# EAGLE schematic fish_electronics2 (EAGLE 6.3)

## Sheet 1 of 4
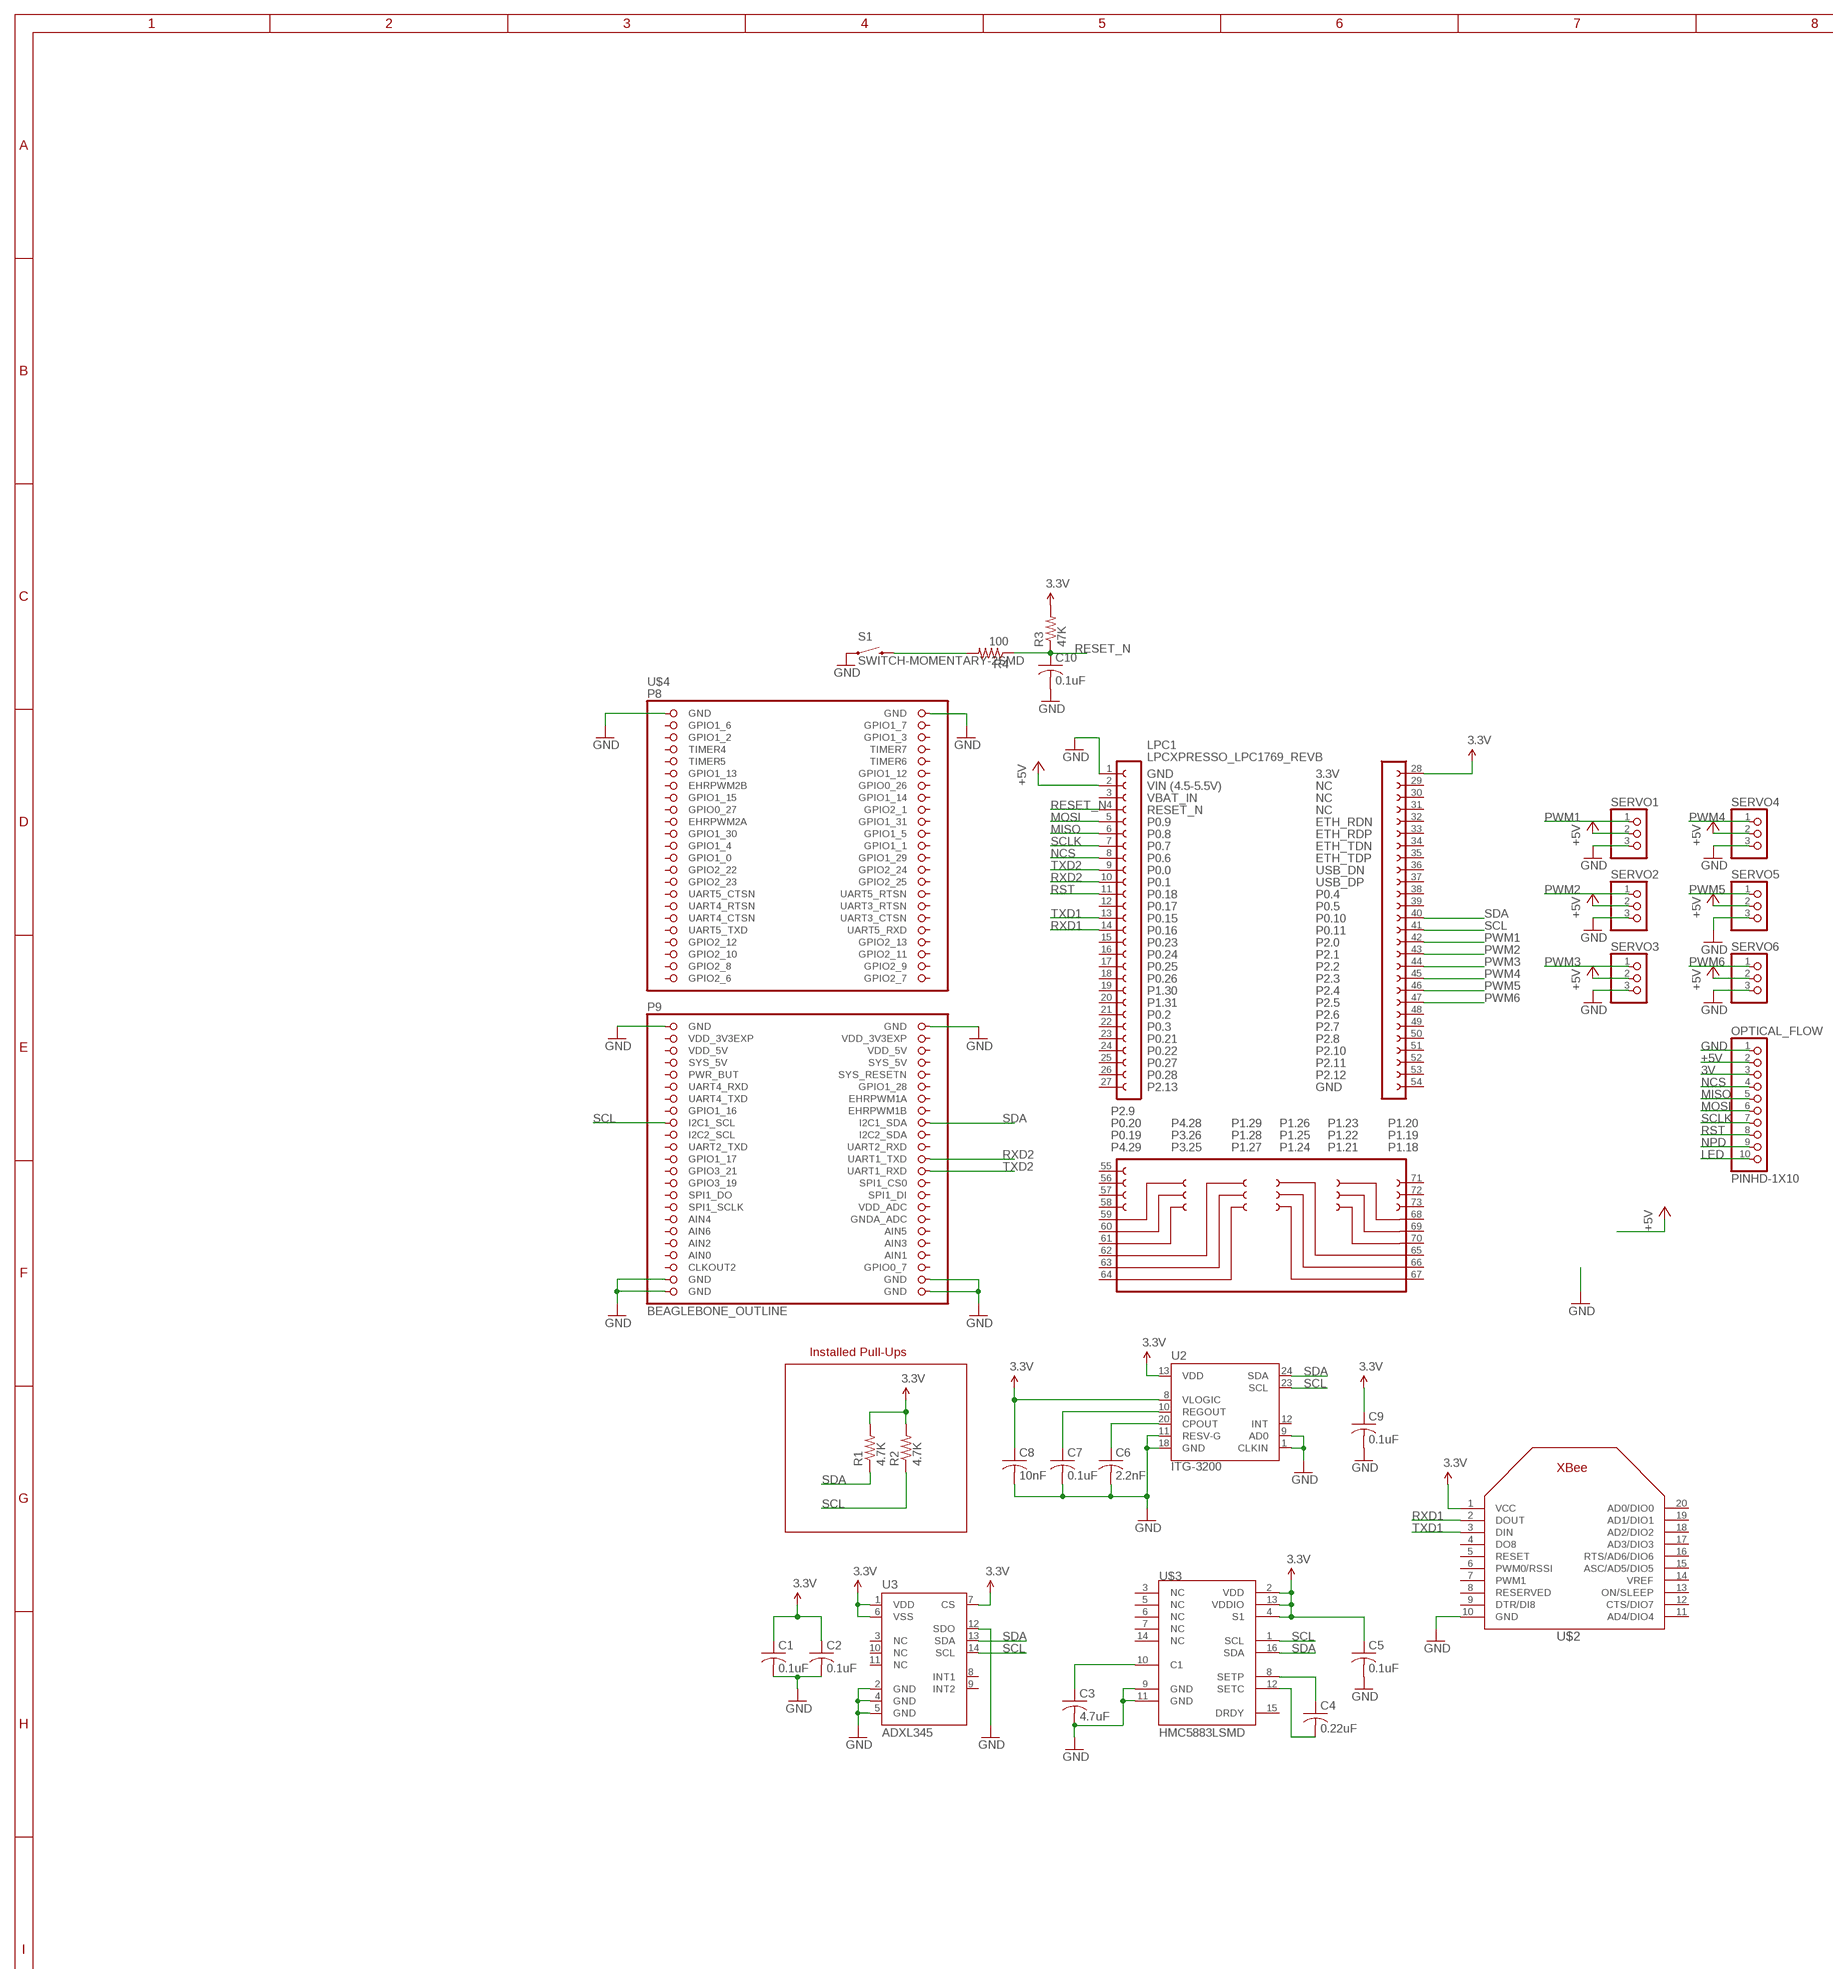
[diagram p0: schematic, sheet 1, part 1 of 2]
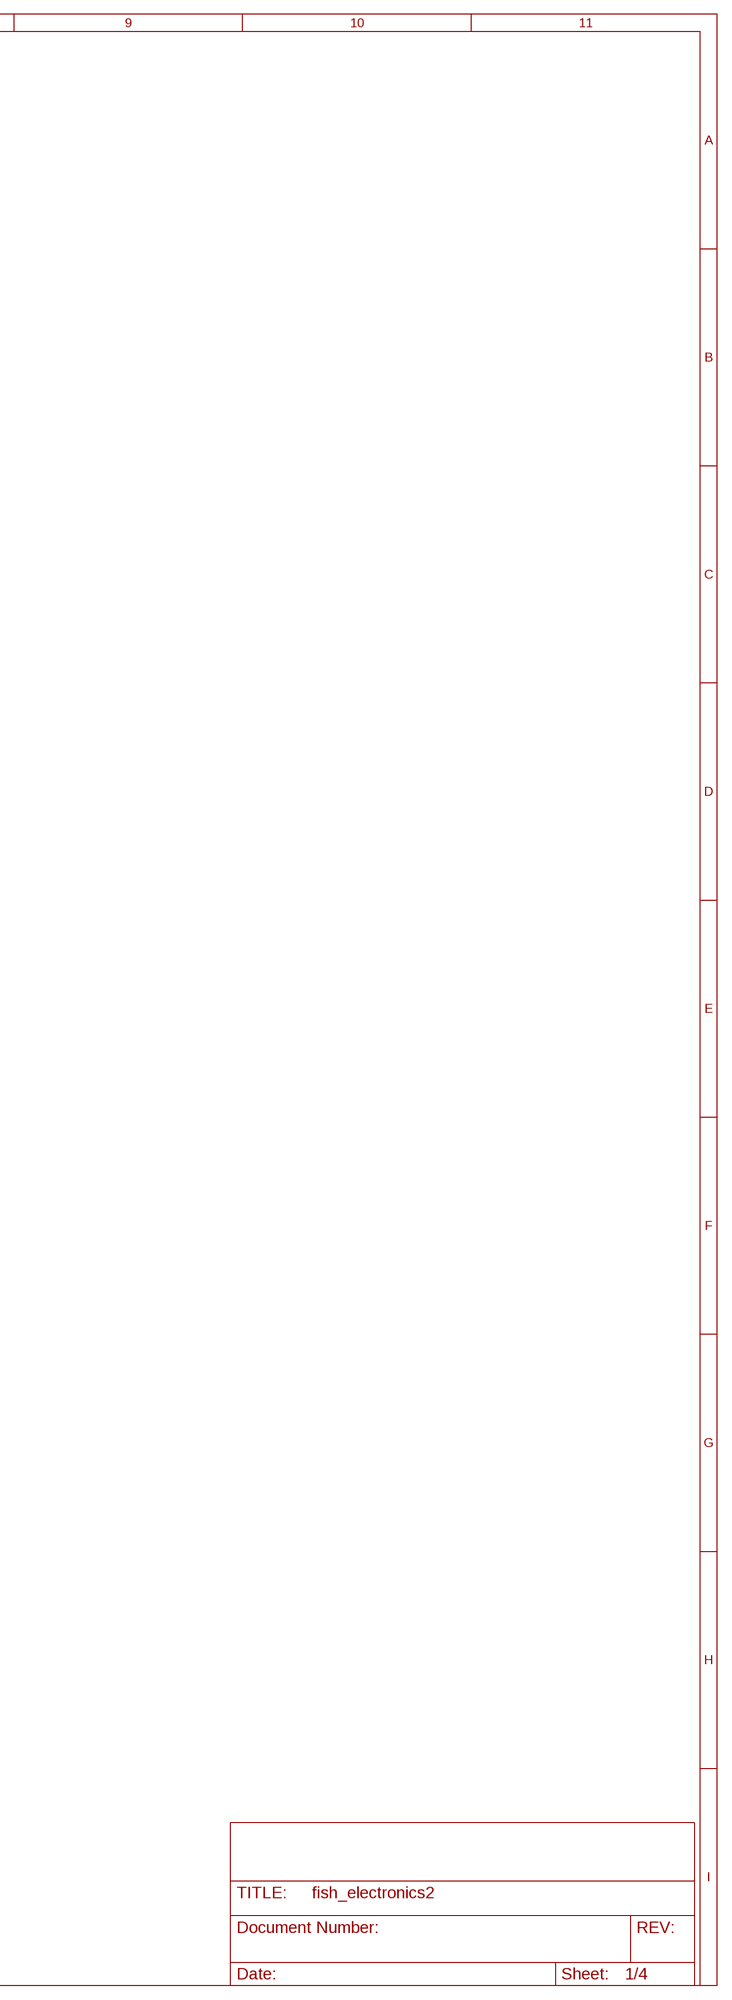
[diagram p1: schematic, sheet 1, part 2 of 2]

### Parts
C1  0.1uF  C-USC0805  [C0805]
C2  0.1uF  C-USC0805  [C0805]
C3  4.7uF  C-USC0805  [C0805]
C4  0.22uF  C-USC0805  [C0805]
C5  0.1uF  C-USC0805  [C0805]
C6  2.2nF  C-USC0805  [C0805]
C7  0.1uF  C-USC0805  [C0805]
C8  10nF  C-USC0805  [C0805]
C9  0.1uF  C-USC0805  [C0805]
C10  0.1uF  C-USC0805  [C0805]
LPC1  LPCXPRESSO_LPC1769_REVB  [LPCXPRESSO_LPC1769]
OPTICAL_FLOW  PINHD-1X10  [1X10-BIG]
R1  4.7K  R-US_R0805  [R0805]
R2  4.7K  R-US_R0805  [R0805]
R3  47K  R-US_R0805  [R0805]
R4  100  R-US_R0805  [R0805]
S1  SWITCH-MOMENTARY-2SMD  [TACTILE_SWITCH_SMD]
SERVO1  PINHD-1X3CB  [1X03-CLEANBIG]
SERVO2  PINHD-1X3CB  [1X03-CLEANBIG]
SERVO3  PINHD-1X3CB  [1X03-CLEANBIG]
SERVO4  PINHD-1X3CB  [1X03-CLEANBIG]
SERVO5  PINHD-1X3CB  [1X03-CLEANBIG]
SERVO6  PINHD-1X3CB  [1X03-CLEANBIG]
U2  ITG-3200  [QFN-24]
U3  ADXL345  [LGA14]
U$2  XBEE  [XBEE]
U$3  HMC5883LSMD  [16LPCC]
U$4  BEAGLEBONE_OUTLINE  [BEAGLEBONE_SHIELD]

### Nets
3.3V: C1.1 C2.1 C5.1 C8.1 C9.1 LPC1.28 R1.2 R2.2 R3.2 U2.8(VLOGIC) U2.13(VDD) U3.1(VDD) U3.6(VSS) U3.7(CS) U$2.1(VCC) U$3.2(VDD) U$3.4(S1) U$3.13(VDDIO)
3V: OPTICAL_FLOW.3
+5V: LPC1.2 OPTICAL_FLOW.2 SERVO1.2 SERVO2.2 SERVO3.2 SERVO4.2 SERVO5.2 SERVO6.2
GND: C1.2 C2.2 C3.2 C5.2 C6.2 C7.2 C8.2 C9.2 C10.2 LPC1.1 OPTICAL_FLOW.1 S1.1 SERVO1.3 SERVO2.3 SERVO3.3 SERVO4.3 SERVO5.3 SERVO6.3 U2.1(CLKIN) U2.9(AD0) U2.11(RESV-G) U2.18(GND) U3.2(GND) U3.4(GND) U3.5(GND) U3.12(SDO) U$2.10(GND) U$3.9(GND) U$3.11(GND) U$4.1(GND) U$4.2(GND) U$4.47(GND) U$4.48(GND) U$4.89(GND) U$4.90(GND) U$4.91(GND) U$4.92(GND) ; also sheet 2,3,4
LED: OPTICAL_FLOW.10
M3_NRESET_BTN: R4.2 S1.3
MISO: LPC1.6 OPTICAL_FLOW.5
MOSI: LPC1.5 OPTICAL_FLOW.6
N$1: C3.1 U$3.10(C1)
N$2: C4.1 U$3.8(SETP)
N$3: C4.2 U$3.12(SETC)
N$5: C6.1 U2.20(CPOUT)
N$7: C7.1 U2.10(REGOUT)
NCS: LPC1.8 OPTICAL_FLOW.4
NPD: OPTICAL_FLOW.9
PWM1: LPC1.42 SERVO1.1
PWM2: LPC1.43 SERVO2.1
PWM3: LPC1.44 SERVO3.1
PWM4: LPC1.45 SERVO4.1
PWM5: LPC1.46 SERVO5.1
PWM6: LPC1.47 SERVO6.1
RESET_N: C10.1 LPC1.4 R3.1 R4.1
RST: LPC1.11 OPTICAL_FLOW.8
RXD1: LPC1.14 U$2.2(DOUT)
RXD2: LPC1.10 U$4.70(UART1_TXD)
SCL: LPC1.41 R2.1 U2.23(SCL) U3.14(SCL) U$3.1(SCL) U$4.63(I2C1_SCL)
SCLK: LPC1.7 OPTICAL_FLOW.7
SDA: LPC1.40 R1.1 U2.24(SDA) U3.13(SDA) U$3.16(SDA) U$4.64(I2C1_SDA)
TXD1: LPC1.13 U$2.3(DIN)
TXD2: LPC1.9 U$4.72(UART1_RXD)
Unconnected: LPC1.3 LPC1.12 LPC1.15 LPC1.16 LPC1.17 LPC1.18 LPC1.19 LPC1.20 LPC1.21 LPC1.22 LPC1.23 LPC1.24 LPC1.25 LPC1.26 LPC1.27 LPC1.29 LPC1.30 LPC1.31 LPC1.32 LPC1.33 LPC1.34 LPC1.35 LPC1.36 LPC1.37 LPC1.38 LPC1.39 LPC1.48 LPC1.49 LPC1.50 LPC1.51 LPC1.52 LPC1.53 LPC1.54 LPC1.55 LPC1.56 LPC1.57 LPC1.58 LPC1.59 LPC1.60 LPC1.61 LPC1.62 LPC1.63 LPC1.64 LPC1.65 LPC1.66 LPC1.67 LPC1.68 LPC1.69 LPC1.70 LPC1.71 LPC1.72 LPC1.73 U2.12(INT) U3.3(NC) U3.8(INT1) U3.9(INT2) U3.10(NC) U3.11(NC) U$2.4(DO8) U$2.5(RESET) U$2.6(PWM0/RSSI) U$2.7(PWM1) U$2.8(RESERVED) U$2.9(DTR/DI8) U$2.11(AD4/DIO4) U$2.12(CTS/DIO7) U$2.13(ON/SLEEP) U$2.14(VREF) U$2.15(ASC/AD5/DIO5) U$2.16(RTS/AD6/DIO6) U$2.17(AD3/DIO3) U$2.18(AD2/DIO2) U$2.19(AD1/DIO1) U$2.20(AD0/DIO0) U$3.3(NC) U$3.5(NC) U$3.6(NC) U$3.7(NC) U$3.14(NC) U$3.15(DRDY) U$4.3(GPIO1_6) U$4.4(GPIO1_7) U$4.5(GPIO1_2) U$4.6(GPIO1_3) U$4.7(TIMER4) U$4.8(TIMER7) U$4.9(TIMER5) U$4.10(TIMER6) U$4.11(GPIO1_13) U$4.12(GPIO1_12) U$4.13(EHRPWM2B) U$4.14(GPIO0_26) U$4.15(GPIO1_15) U$4.16(GPIO1_14) U$4.17(GPIO0_27) U$4.18(GPIO2_1) U$4.19(EHRPWM2A) U$4.20(GPIO1_31) U$4.21(GPIO1_30) U$4.22(GPIO1_5) U$4.23(GPIO1_4) U$4.24(GPIO1_1) U$4.25(GPIO1_0) U$4.26(GPIO1_29) U$4.27(GPIO2_22) U$4.28(GPIO2_24) U$4.29(GPIO2_23) U$4.30(GPIO2_25) U$4.31(UART5_CTSN) U$4.32(UART5_RTSN) U$4.33(UART4_RTSN) U$4.34(UART3_RTSN) U$4.35(UART4_CTSN) U$4.36(UART3_CTSN) U$4.37(UART5_TXD) U$4.38(UART5_RXD) U$4.39(GPIO2_12) U$4.40(GPIO2_13) U$4.41(GPIO2_10) U$4.42(GPIO2_11) U$4.43(GPIO2_8) U$4.44(GPIO2_9) U$4.45(GPIO2_6) U$4.46(GPIO2_7) U$4.54(SYS_5V) U$4.55(PWR_BUT) U$4.56(SYS_RESETN) U$4.57(UART4_RXD) U$4.58(GPIO1_28) U$4.59(UART4_TXD) U$4.60(EHRPWM1A) U$4.61(GPIO1_16) U$4.62(EHRPWM1B) U$4.65(I2C2_SCL) U$4.66(I2C2_SDA) U$4.67(UART2_TXD) U$4.68(UART2_RXD) U$4.69(GPIO1_17) U$4.71(GPIO3_21) U$4.73(GPIO3_19) U$4.74(SPI1_CS0) U$4.75(SPI1_DO) U$4.76(SPI1_DI) U$4.77(SPI1_SCLK) U$4.78(VDD_ADC) U$4.79(AIN4) U$4.80(GNDA_ADC) U$4.81(AIN6) U$4.82(AIN5) U$4.83(AIN2) U$4.84(AIN3) U$4.86(AIN1) U$4.87(CLKOUT2) U$4.88(GPIO0_7)

### Notes on the sheet
- Installed Pull-Ups

## Sheet 2 of 4
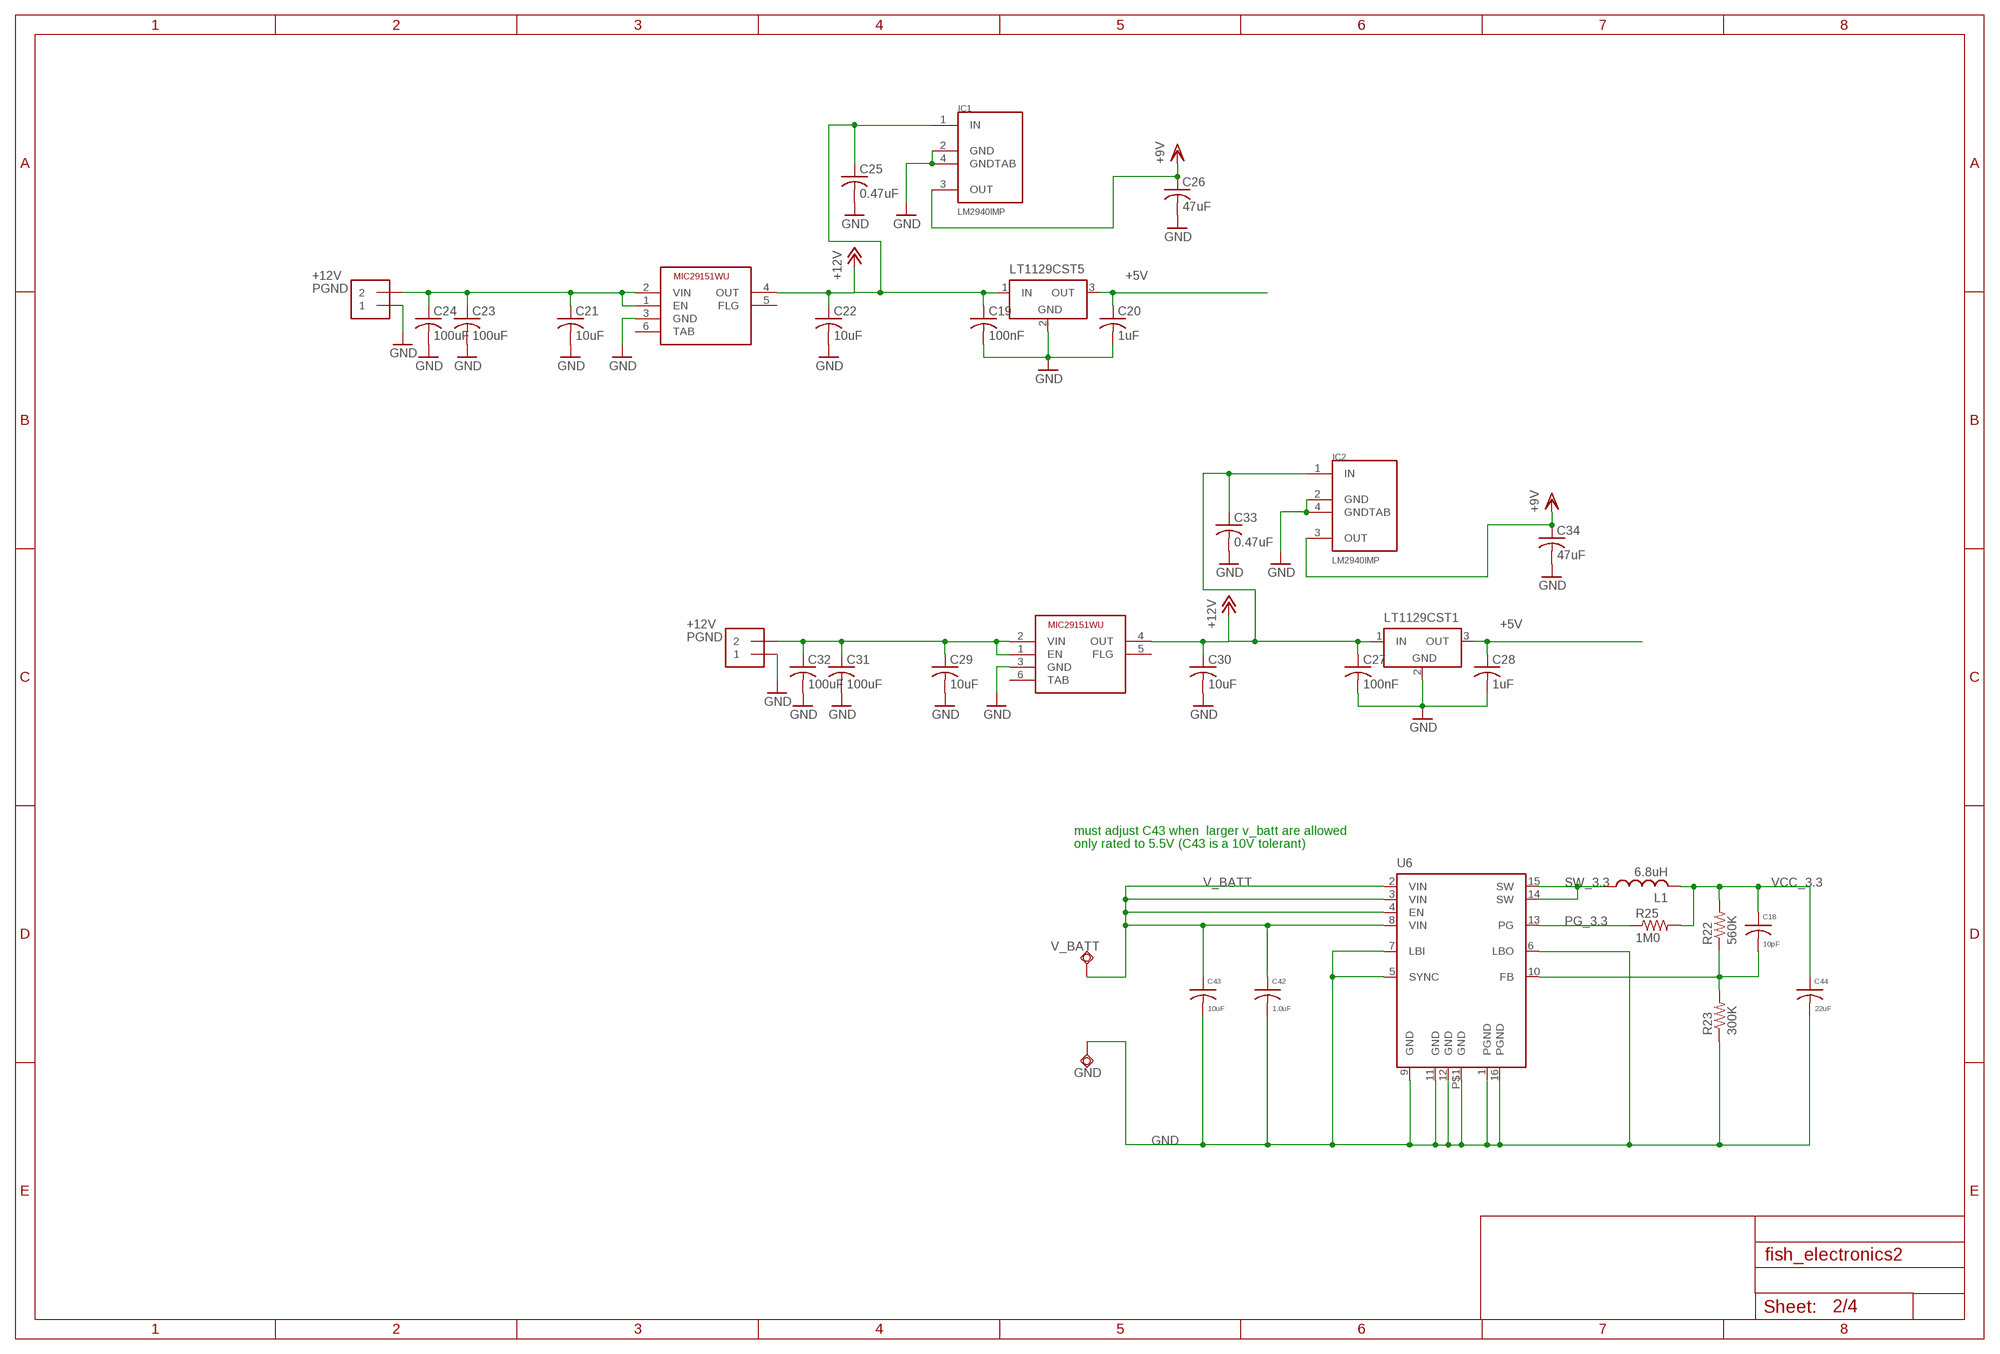
[diagram p2: schematic, sheet 2]

### Parts
C18  10pF  C0402  [C0402]
C19  100nF  C-USC0805  [C0805]
C20  1uF  C-USC0805  [C0805]
C21  10uF  C-USC0805  [C0805]
C22  10uF  C-USC0805  [C0805]
C23  100uF  C-USC2220K  [C2220K]
C24  100uF  C-USC2220K  [C2220K]
C25  0.47uF  C-USC0805  [C0805]
C26  47uF  C-USC1206  [C1206]
C27  100nF  C-USC0805  [C0805]
C28  1uF  C-USC0805  [C0805]
C29  10uF  C-USC0805  [C0805]
C30  10uF  C-USC0805  [C0805]
C31  100uF  C-USC2220K  [C2220K]
C32  100uF  C-USC2220K  [C2220K]
C33  0.47uF  C-USC0805  [C0805]
C34  47uF  C-USC1206  [C1206]
C42  1.0uF  C0603  [C0603]
C43  10uF  C0805  [C0805]
C44  22uF  C0805-R  [C0805R]
GND  TPSQPAD1-17  [P1-17]
IC1  LM2940IMP  [SOT223]
IC2  LM2940IMP  [SOT223]
J1  1X2-3.5MM  [1X2-3.5MM]
J2  1X2-3.5MM  [1X2-3.5MM]
L1  6.8uH  LELL3GM  [ELL3GM]
LT1129CST1  LT1129CST5  [SOT223]
LT1129CST5  LT1129CST5  [SOT223]
R22  560K  R0402-R  [C0402R]
R23  300K  R0402-R  [C0402R]
R25  1M0  R0402-R  [C0402R]
U6  TPS62110  TPS62111  [PQFP16]
U$1  MIC29151WU  [TO263-5]
U$5  MIC29151WU  [TO263-5]
V_BATT  TPSQPAD1-17  [P1-17]

### Nets
+12V [Power3]: C19.1 C22.1 C25.1 C27.1 C30.1 C33.1 IC1.1(IN) IC2.1(IN) LT1129CST1.1(IN) LT1129CST5.1(IN) U$1.4(OUT) U$5.4(OUT)
FB_3.3: C18.2 R22.1 R23.2 U6.10(FB)
GND: C19.2 C20.2 C21.2 C22.2 C23.2 C24.2 C25.2 C26.2 C27.2 C28.2 C29.2 C30.2 C31.2 C32.2 C33.2 C34.2 C42.2 C43.2 C44.2 GND.1(TP) IC1.2(GND) IC1.4(GNDTAB) IC2.2(GND) IC2.4(GNDTAB) J1.1 J2.1 LT1129CST1.2(GND) LT1129CST5.2(GND) R23.1 U6.1(PGND) U6.5(SYNC) U6.6(LBO) U6.7(LBI) U6.9(GND) U6.11(GND) U6.12(GND) U6.16(PGND) U6.P$1(GND) U$1.3(GND) U$5.3(GND) ; also sheet 1,3,4
N$12: C29.1 C31.1 C32.1 J2.2 U$5.1(EN) U$5.2(VIN)
N$13 [Power3]: C28.1 LT1129CST1.3(OUT)
N$19 [Power3]: C20.1 LT1129CST5.3(OUT)
N$22: C21.1 C23.1 C24.1 J1.2 U$1.1(EN) U$1.2(VIN)
PG_3.3: R25.1 U6.13(PG)
SW_3.3: L1.1 U6.14(SW) U6.15(SW)
V_BATT [xxwide]: C42.1 C43.1 U6.2(VIN) U6.3(VIN) U6.4(EN) U6.8(VIN) V_BATT.1(TP)
VCC_3.3 [Power1]: C18.1 C44.1 L1.2 R22.2 R25.2
VDD [Power3]: C26.1 C34.1 IC1.3(OUT) IC2.3(OUT) ; supply symbol labelled +9V
Unconnected: U$1.5(FLG) U$1.6(TAB) U$5.5(FLG) U$5.6(TAB)

### Notes on the sheet
- +12V | +5V
- PGND
- +12V | +5V
- PGND
- must adjust C43 when  larger v_batt are allowed
- only rated to 5.5V (C43 is a 10V tolerant)

## Sheet 3 of 4
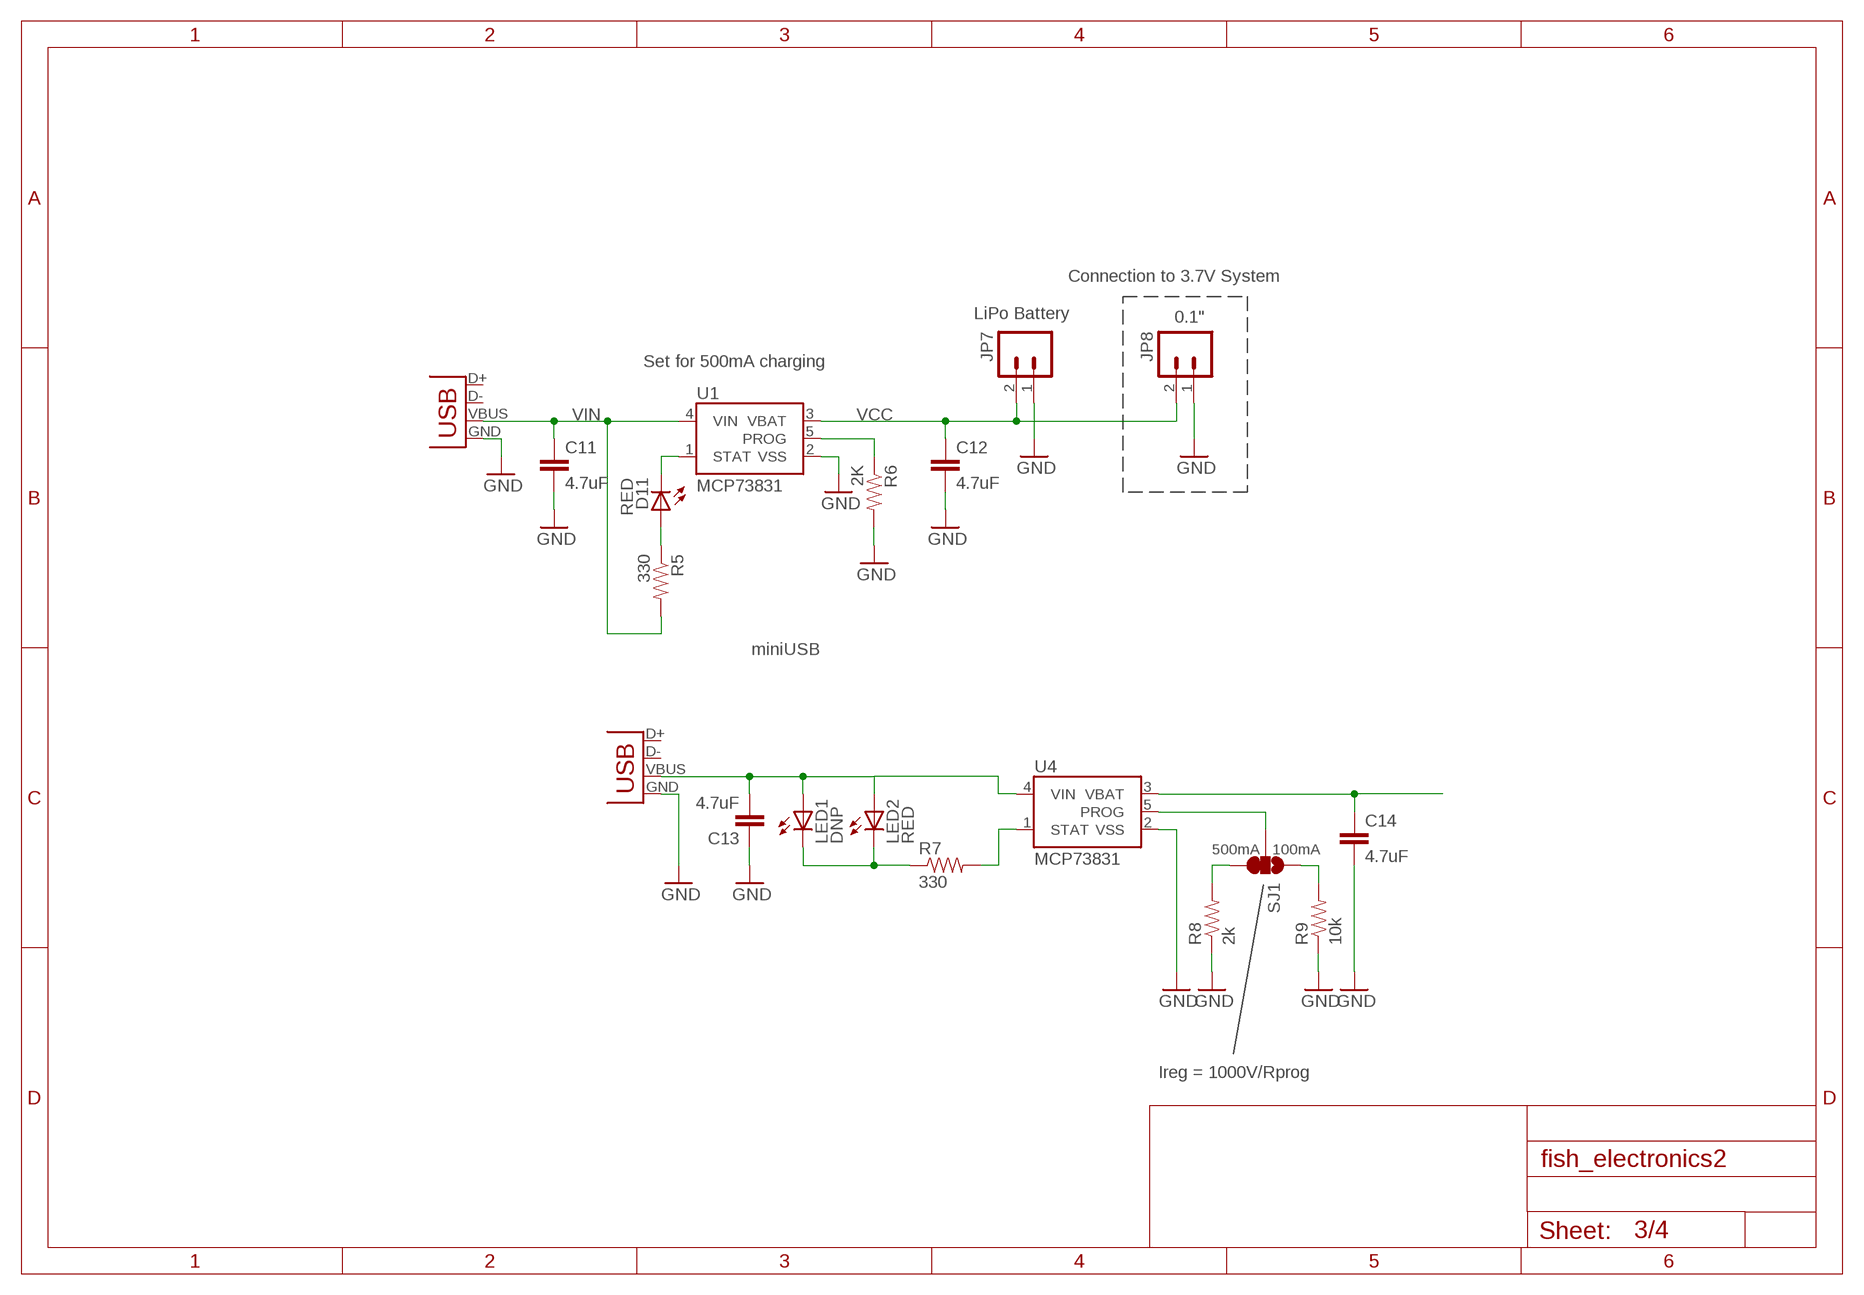
[diagram p3: schematic, sheet 3]

### Parts
C11  4.7uF  CAP0402-CAP  [0402-CAP]
C12  4.7uF  CAP0402-CAP  [0402-CAP]
C13  4.7uF  CAP0402-CAP  [0402-CAP]
C14  4.7uF  CAP0402-CAP  [0402-CAP]
D11  RED  LED0603  [LED-0603]
JP7  LiPo Battery  M02-JST-2MM-SMT  [JST-2-SMD]
JP8  M02PTH  [1X02]
LED1  DNP  LED3MM  [LED3MM]
LED2  RED  LED0603  [LED-0603]
R5  330  RESISTOR0402-RES  [0402-RES]
R6  2K  RESISTOR0402-RES  [0402-RES]
R7  330  RESISTOR0402-RES  [0402-RES]
R8  2k  RESISTOR0402-RES  [0402-RES]
R9  10k  RESISTOR0402-RES  [0402-RES]
SJ1  SOLDERJUMPER_2WAYS  [SJ_3]
U1  MCP73831  [SOT23-5]
U4  MCP73831  [SOT23-5]
X1  Micro USB  USBSMD  [USB-MINIB]
X2  USBSMD  [USB-MINIB]

### Nets
GND: C11.2 C12.2 C13.1 C14.2 JP7.1 JP8.1 R6.2 R8.1 R9.1 U1.2(VSS) U4.2(VSS) X1.GND X2.GND ; also sheet 1,2,4
N$4: D11.A R5.1
N$6: C13.2 LED1.A LED2.A U4.4(VIN) X2.VBUS
N$8: R9.2 SJ1.1
N$9: R8.2 SJ1.3
N$10: R7.2 U4.1(STAT)
N$11: LED1.K(C) LED2.C R7.1
PROG: R6.1 U1.5(PROG)
PROG1: SJ1.2 U4.5(PROG)
STAT: D11.C U1.1(STAT)
VBAT: C14.1 U4.3(VBAT)
VCC: C12.1 JP7.2 JP8.2 U1.3(VBAT) ; also sheet 4
VIN: C11.1 R5.2 U1.4(VIN) X1.VBUS
Unconnected: X1.D+ X1.D- X2.D+ X2.D-

### Notes on the sheet
- Connection to 3.7V System
- 0.1"
- Set for 500mA charging
- miniUSB
- 500mA | 100mA
- Ireg = 1000V/Rprog

## Sheet 4 of 4
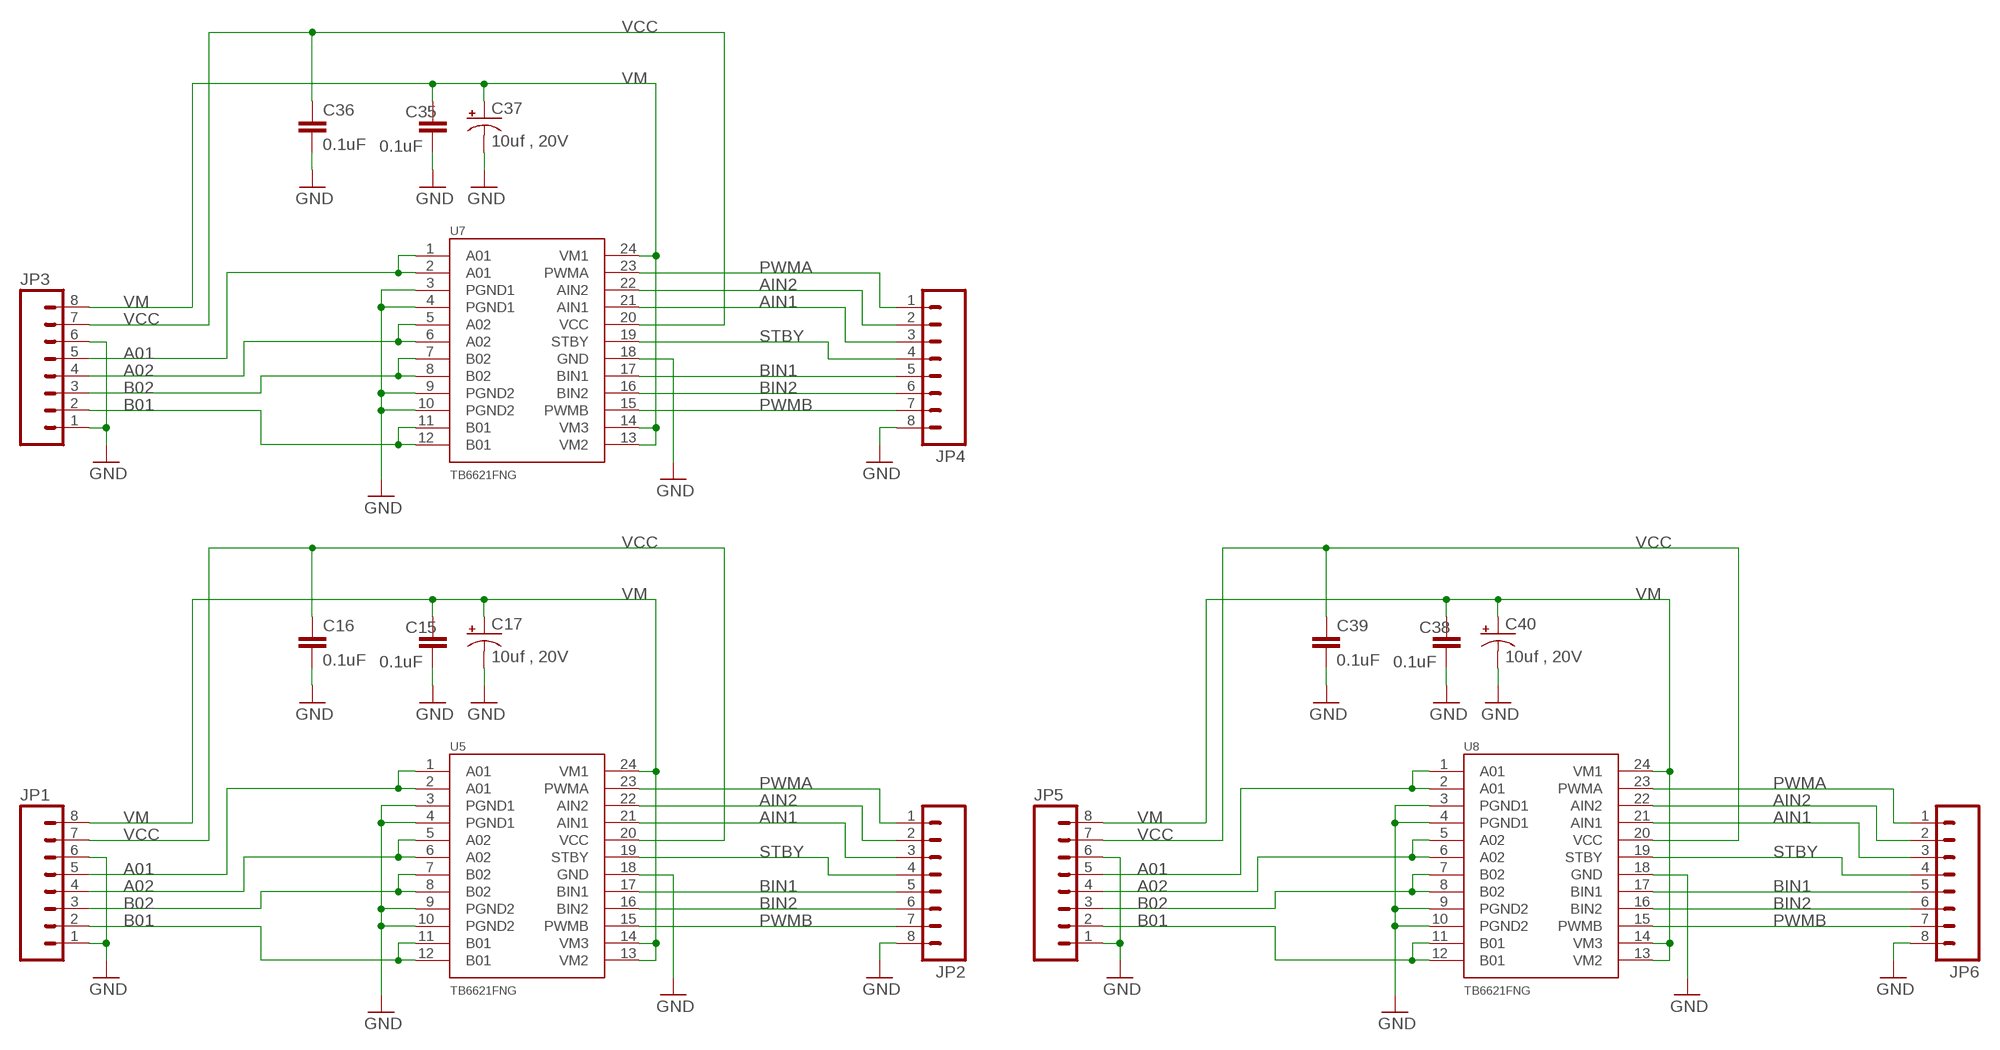
[diagram p4: schematic, sheet 4]

### Parts
C15  0.1uF  CAP0402-CAP  [0402-CAP]
C16  0.1uF  CAP0402-CAP  [0402-CAP]
C17  10uf , 20V  CAP_POL3528  [EIA3528]
C35  0.1uF  CAP0402-CAP  [0402-CAP]
C36  0.1uF  CAP0402-CAP  [0402-CAP]
C37  10uf , 20V  CAP_POL3528  [EIA3528]
C38  0.1uF  CAP0402-CAP  [0402-CAP]
C39  0.1uF  CAP0402-CAP  [0402-CAP]
C40  10uf , 20V  CAP_POL3528  [EIA3528]
JP1  M08LONGPADS  [1X08_LONGPADS]
JP2  M08LONGPADS  [1X08_LONGPADS]
JP3  M08LONGPADS  [1X08_LONGPADS]
JP4  M08LONGPADS  [1X08_LONGPADS]
JP5  M08LONGPADS  [1X08_LONGPADS]
JP6  M08LONGPADS  [1X08_LONGPADS]
U5  TB6621FNG  [SSOP24]
U7  TB6621FNG  [SSOP24]
U8  TB6621FNG  [SSOP24]

### Nets
A01: JP1.5 JP3.5 JP5.5 U5.1(A01) U5.2(A01) U7.1(A01) U7.2(A01) U8.1(A01) U8.2(A01)
A02: JP1.4 JP3.4 JP5.4 U5.5(A02) U5.6(A02) U7.5(A02) U7.6(A02) U8.5(A02) U8.6(A02)
AIN1: JP2.3 JP4.3 JP6.3 U5.21(AIN1) U7.21(AIN1) U8.21(AIN1)
AIN2: JP2.2 JP4.2 JP6.2 U5.22(AIN2) U7.22(AIN2) U8.22(AIN2)
B01: JP1.2 JP3.2 JP5.2 U5.11(B01) U5.12(B01) U7.11(B01) U7.12(B01) U8.11(B01) U8.12(B01)
B02: JP1.3 JP3.3 JP5.3 U5.7(B02) U5.8(B02) U7.7(B02) U7.8(B02) U8.7(B02) U8.8(B02)
BIN1: JP2.5 JP4.5 JP6.5 U5.17(BIN1) U7.17(BIN1) U8.17(BIN1)
BIN2: JP2.6 JP4.6 JP6.6 U5.16(BIN2) U7.16(BIN2) U8.16(BIN2)
GND: C15.2 C16.2 C17.C(-) C35.2 C36.2 C37.C(-) C38.2 C39.2 C40.C(-) JP1.1 JP1.6 JP2.8 JP3.1 JP3.6 JP4.8 JP5.1 JP5.6 JP6.8 U5.3(PGND1) U5.4(PGND1) U5.9(PGND2) U5.10(PGND2) U5.18(GND) U7.3(PGND1) U7.4(PGND1) U7.9(PGND2) U7.10(PGND2) U7.18(GND) U8.3(PGND1) U8.4(PGND1) U8.9(PGND2) U8.10(PGND2) U8.18(GND) ; also sheet 1,2,3
PWMA: JP2.1 JP4.1 JP6.1 U5.23(PWMA) U7.23(PWMA) U8.23(PWMA)
PWMB: JP2.7 JP4.7 JP6.7 U5.15(PWMB) U7.15(PWMB) U8.15(PWMB)
STBY: JP2.4 JP4.4 JP6.4 U5.19(STBY) U7.19(STBY) U8.19(STBY)
VCC: C16.1 C36.1 C39.1 JP1.7 JP3.7 JP5.7 U5.20(VCC) U7.20(VCC) U8.20(VCC) ; also sheet 3
VM: C15.1 C17.A(+) C35.1 C37.A(+) C38.1 C40.A(+) JP1.8 JP3.8 JP5.8 U5.13(VM2) U5.14(VM3) U5.24(VM1) U7.13(VM2) U7.14(VM3) U7.24(VM1) U8.13(VM2) U8.14(VM3) U8.24(VM1)

## Power pins joined to a net without a drawn wire
AIN0: U$4.85(AIN0)
GND: LT1129CST1.4(GND) LT1129CST5.4(GND)
SYS_5V: U$4.53(SYS_5V)
VDD_3V3EXP: U$4.49(VDD_3V3EXP) U$4.50(VDD_3V3EXP)
VDD_5V: U$4.51(VDD_5V) U$4.52(VDD_5V)

## Library data of the parts
C1-C10 C19-C34 = rcl:C-US: CAPACITOR, American symbol
C11-C16 C35 C36 C38 C39 = SparkFun:CAP: Capacitor Standard 0603 ceramic capacitor, and 0.1" leaded capacitor.
C17 C37 C40 = SparkFun:CAP_POL: Capacitor Polarized These are standard SMD and PTH capacitors. Normally 10uF, 47uF, and 100uF in electrolytic and tantalum varieties. Always verify the external diameter of the through hole cap, it varies with capacity, voltage, and manufacturer. The EIA devices should be standard.
C18 = qualified_1:C; DM: 0; DR: 90.000; DX: 47.400; DY: 38.400; SHEETNO: 2
C42-C44 = qualified_1:C
D11 LED1 LED2 = SparkFun:LED: LEDs Standard schematic elements and footprints for 5mm, 3mm, 1206, and 0603 sized LEDs. 5mm - Spark Fun Electronics SKU : COM-00529 (and others)
GND V_BATT = testpad:TPSQ: Test pad
IC1 IC2 = CEDT:LM2940
J1 J2 = adafruit:1X2: 3.5mm Terminal block http://www.ladyada.net/library/pcb/eaglelibrary.html
JP1-JP6 = SparkFun:M08: Header 8 Standard 8-pin 0.1" header. Use with straight break away headers (SKU : PRT-00116), right angle break away headers (PRT-00553), swiss pins (PRT-00743), machine pins (PRT-00117), and female headers (PRT-00115).
JP7 JP8 = SparkFun:M02: Header 2 Standard 2-pin 0.1" header. Use with straight break away headers (SKU : PRT-00116), right angle break away headers (PRT-00553), swiss pins (PRT-00743), machine pins (PRT-00117), and female headers (PRT-00115). Molex polarized connector foot print use with SKU : PRT-08233 with associated crimp pins and housings.
L1 = qualified_1:L
LPC1 = LPCXpresso_boards:LPCXPRESSO_LPC1769_REVB
LT1129CST1 LT1129CST5 = linear-technology:LT1129CST5: VOLTAGE REGULATOR with shutdown; MPN: LT1129CST-5#PBF; OC_FARNELL: 1663375; OC_NEWARK: 57M2069
OPTICAL_FLOW = adafruit:PINHD-1X10: Pin header 1x10 0.1" spacing With round pins
R1-R4 = rcl:R-US_: RESISTOR, American symbol
R5-R9 = SparkFun:RESISTOR: Resistor Basic schematic elements and footprints for 0603, 1206, and PTH resistors.
R22 R23 R25 = qualified_1:R
S1 = SparkFun-Electromechanical:SWITCH-MOMENTARY-2: Various NO switches- pushbuttons, reed, etc
SERVO1-SERVO6 = adafruit:PINHD-1X3: PIN HEADER
SJ1 = SparkFun:SOLDERJUMPER_2WAY: Solder Jumper 2 way solder jumper
U1 U4 = SparkFun:MCP73831: Microchip's MCP73831 Miniature single cell, fully integrated Li-Ion, Li-polymer charge management controller http://ww1.microchip.com/downloads/en/DeviceDoc/21984a.pdf
U2 = SparkFun:ITG-3200: ITG-3200 3-axis gyro, digital output, qfn24 package
U3 = SparkFun:ADXL345
U5 U7 U8 = SparkFun:TB6621FNG: Toshiba 1A motor driver
U6 = qualified_1:TPS62111
U$1 U$5 = MIC29_v_reg:MIC29151WU
U$2 = adafruit:XBEE
U$3 = SparkFun:HMC5883L: 3 Axis Digital Compass IC
U$4 = adafruit:BEAGLEBONE_OUTLINE: Should match A3 pinout - but not completely tested
X1 X2 = SparkFun:USB: USB Connectors USB-B-PTH is fully proven SKU : PRT-00139 USB-miniB is fully proven SKU : PRT-00587 USB-A-PCB is untested. USB-A-H is throughly reviewed, but untested. Spark Fun Electronics SKU : PRT-00437 USB-B-SMT is throughly reviewed, but untested. Needs silkscreen touching up. USB-A-S has not been used/tested USB-MB-H has not been used/tested

## Net classes
1 Power1: width 0.254 mm, drill 0.508 mm, clearance 0.254 mm
2 Gound1: width 0.254 mm, drill 0.508 mm, clearance 0.254 mm
4 xxwide: width 0.203 mm
5 Power3: width 0.305 mm, drill 0.508 mm, clearance 0.254 mm
6 Gound3: width 0.305 mm, drill 0.508 mm, clearance 0.254 mm